# EAGLE design lightamp (EAGLE 9.5.1)
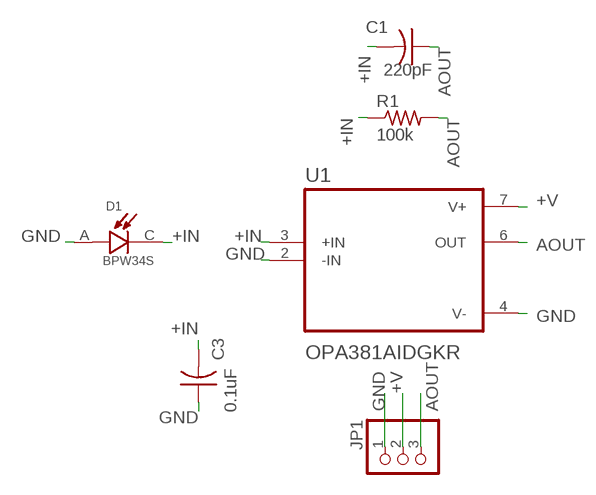
[diagram p0: schematic, sheet 1]

## Parts
C1  220pF  C-US025-025X050  [C025-025X050]
C3  0.1uF  C-US025-025X050  [C025-025X050]
D1  BPW34S  [DIO_BPW34S]
JP1  PINHD-1X3  [1X03]
R1  100k  R-US_0204/5  [0204/5]
U1  OPA381AIDGKR  [SOP65P490X110-8N]

## Nets
+IN: C1.2 C3.2 D1.C R1.1 U1.3(+IN)
+V: JP1.2 U1.7(V+)
AOUT: C1.1 JP1.3 R1.2 U1.6(OUT)
GND: C3.1 D1.A JP1.1 U1.2(-IN) U1.4(V-)

## Library data of the parts
C1 C3 = adafruit:C-US: CAPACITOR, American symbol
D1 = BPW34S:BPW34S: PHOTODIODE; Wavelength Typ: 850nm; Sensitivity: 0.62A/W; Half Angle: 60°; Dark Current: 2nA; No. of Pins: 2; Check availability <https://pricing.snapeda.com/parts/BPW34S/Vishay%20Semiconductor%20Opto%20Division/view-part?ref=eda>; AVAILABILITY: In Stock; DESCRIPTION: Photodiode 900nm - 130° 2-DIP; MF: Vishay Semiconductor Opto Division; MP: BPW34S; PACKAGE: None; PRICE: None; PURCHASE-URL: https://pricing.snapeda.com/search/part/BPW34S/?ref=eda
JP1 = adafruit:PINHD-1X3: PIN HEADER
R1 = adafruit:R-US_: RESISTOR, American symbol
U1 = OPA381AIDGKR:OPA381AIDGKR: Check availability <https://pricing.snapeda.com/parts/OPA381AIDGKR/Texas%20Instruments/view-part?ref=eda>; AVAILABILITY: In Stock; DESCRIPTION: Precision, Low Power, High-Speed Transimpedance Amplifier 8-VSSOP -40 to 125; MF: Texas Instruments; MP: OPA381AIDGKR; PACKAGE: VSSOP-8 Texas Instruments; PRICE: None; PURCHASE-URL: https://pricing.snapeda.com/search/part/OPA381AIDGKR/?ref=eda

## Board
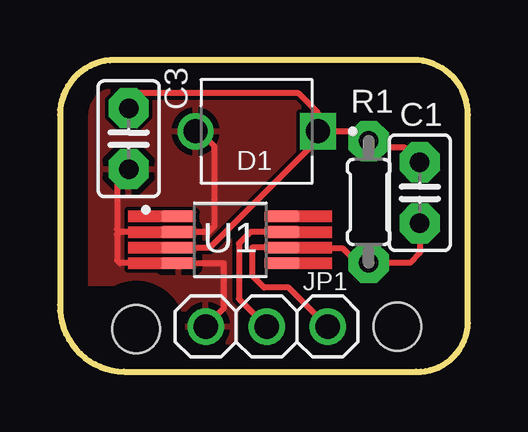
[diagram p1: board, top side]
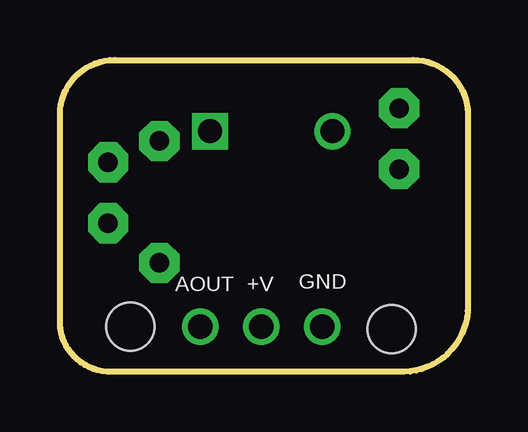
[diagram p2: board, bottom side, seen from below]

Size 17.02 x 13.01 mm. Coordinates in mm from the lower left corner, seen from the top.
Outline: 0,2.79 arc90 2.67,0 14.86,0 arc90 17.02,2.04 17.02,10.72 arc90 14.73,13.01 2.29,13 arc90 0,10.72 0,2.79
Copper layers (1*16): Top 0.035mm / dielectric 1.5mm / Bottom 0.035mm
Design rules "default": minimum track width 6mil, minimum drill 0.35mm, track to track 6mil, track to pad 6mil, pad to pad 6mil, via to via 6mil, smd to smd 6mil, copper to edge 40mil, drill to drill 6mil, minimum pad ring 10mil, minimum via ring 8mil, stop-mask expansion 4mil, vias tented up to drill 0mil, thermal gap 10mil
Holes 2 mm at 3.18,1.78 14.07,1.88

### Footprints (pad centres in the part's own frame; a part is rotated, then mirrored left to right if it is on the bottom)
C025-025X050 = drill 0.813 pad 1.676 octagon: 1 -1.27,0; 2 1.27,0
DIO_BPW34S = drill 1 pad 1.5: A 2.55,0 | drill 1 pad 1.5 square: C -2.55,0
1X03 = drill 1.016: 1 -2.54,0; 2 0,0; 3 2.54,0
0204/5 = drill 0.813 pad 1.676 octagon: 1 -2.54,0; 2 2.54,0
SOP65P490X110-8N = smd 1.47 x 0.48: 1 -2.15,0.975; 2 -2.15,0.325; 3 -2.15,-0.325; 4 -2.15,-0.975; 5 2.15,-0.975; 6 2.15,-0.325; 7 2.15,0.325; 8 2.15,0.975

### Placement (x,y rotation side)
C1  15.01,7.47 90 top
C3  2.87,9.72 90 top
D1  8.2,10.03 180 top
JP1  8.62,1.89 0 top
R1  12.87,7.08 270 top
U1  7.1,5.5 0 top

### Tracks (layer width: path | path; a pad name or v marks a point on that pad's centre or on a via)
+IN
  Top 0.254: U1.3 6.25,5.18 10.74,9.67 10.74,10.03 D1.C | C3.2 2.87,11.16 3.32,11.61 9.95,11.61 10.75,10.81 D1.C | D1.C 12.51,10.03 12.87,9.66 R1.1 13.15,9.34 14.4,9.34 C1.2
+V
  Top 0.254: U1.7 7.95,5.83 7.46,5.35 7.46,3.05 JP1.2
AOUT
  Top 0.254: C1.1 15.01,4.95 14.6,4.54 R1.2 | R1.2 12.89,4.52 | R1.2 12.4,4.54 11.81,5.14 9.29,5.14 U1.6 8.02,5.18 8.02,4.02 8.52,3.51 9.53,3.51 JP1.3
GND
  Top 0.254: D1.A 5.82,10.03 6.43,9.41 6.43,6.07 6.19,5.83 U1.2 2.5,5.83 | 2.5,5.83 2.38,5.72 2.38,4.65 2.5,4.53 U1.4 6.83,4.53 6.83,2.64 JP1.1 | C3.1 2.38,7.97 2.38,5.94 2.5,5.83
  pour Top: 1.19,3.71 3.76,3.71 4.78,2.69 4.78,1.3 5.49,0.58 6.65,0.58 7.32,1.24 7.32,2.49 7.9,3.07 14.22,3.07 16,4.85 16,12.22 1.19,12.22
(copper drawn outside any net)
  shapes: Top area x8

### Text on the board
bPlace: GND | +V | AOUT